# Altium schematic sheet Sheet1.SchDoc
size A4
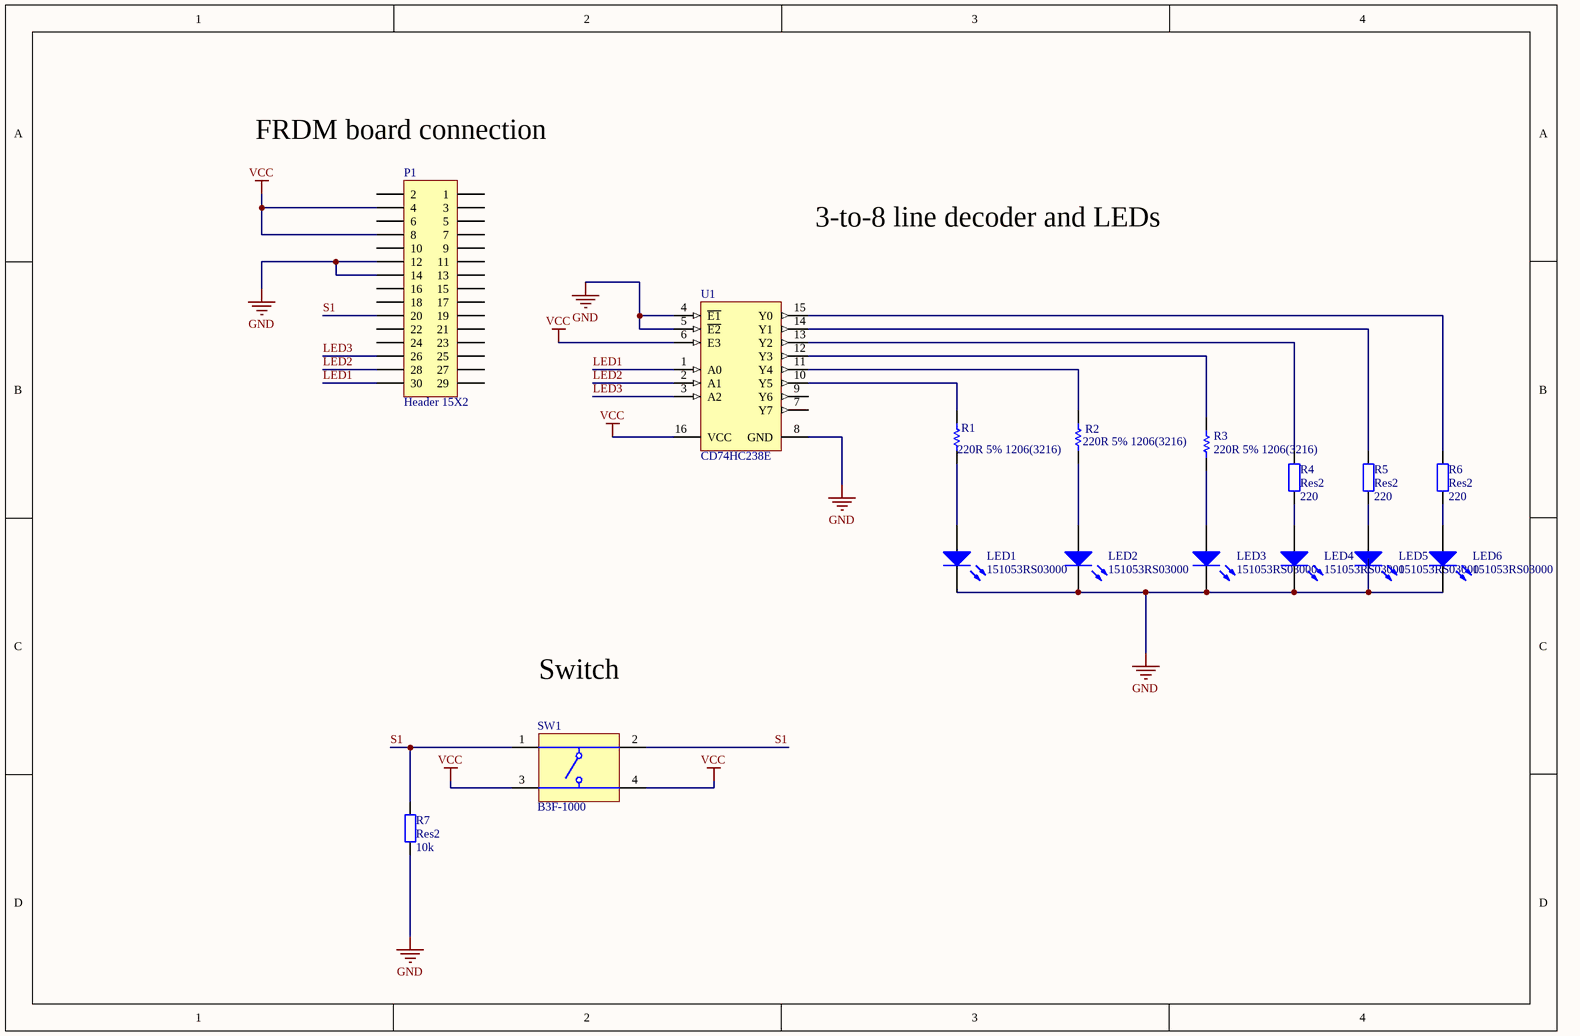
[diagram p0: Sheet1.SchDoc]

## Parts
LED1  151053RS03000  [Type 5mm]
LED2  151053RS03000  [Type 5mm]
LED3  151053RS03000  [Type 5mm]
LED4  151053RS03000  [Type 5mm]
LED5  151053RS03000  [Type 5mm]
LED6  151053RS03000  [Type 5mm]
P1  Header 15X2  [HDR2X15]
R1  220R 5% 1206(3216)  [RESC1206(3216)_M]
R2  220R 5% 1206(3216)  [RESC1206(3216)_M]
R3  220R 5% 1206(3216)  [RESC1206(3216)_M]
R4  Res2  value 220  [AXIAL-0.4]
R5  Res2  value 220  [AXIAL-0.4]
R6  Res2  value 220  [AXIAL-0.4]
R7  Res2  value 10k  [AXIAL-0.4]
SW1  B3F-1000  [OMRON-B3F-1000-4_V]
U1  CD74HC238E  [N0016A]

## Nets
GND: LED1.1(K) LED2.1(K) LED3.1(K) LED4.1(K) LED5.1(K) LED6.1(K) P1.12 P1.14 R7.1 U1.4(~{E1}) U1.5(~{E2}) U1.8(GND)
VCC: P1.4 P1.8 SW1.3 SW1.4 U1.6(E3) U1.16(VCC)
LED1: P1.30 U1.1(A0)
LED2: P1.28 U1.2(A1)
LED3: P1.26 U1.3(A2)
S1: P1.20 R7.2 SW1.1 SW1.2
NetLED1_2: LED1.2(A) R1.1
NetLED2_2: LED2.2(A) R2.1
NetLED3_2: LED3.2(A) R3.1
NetLED4_2: LED4.2(A) R4.1
NetLED5_2: LED5.2(A) R5.1
NetLED6_2: LED6.2(A) R6.1
NetR1_2: R1.2 U1.10(Y5)
NetR2_2: R2.2 U1.11(Y4)
NetR3_2: R3.2 U1.12(Y3)
NetR4_2: R4.2 U1.13(Y2)
NetR5_2: R5.2 U1.14(Y1)
NetR6_2: R6.2 U1.15(Y0)

Not connected (* = marked no-connect by the designer): P1 1 2 3 5 6 7 9 10 11 13 15 16 17 18 19 21 22 23 24 25 27 29; U1 7(Y7) 9(Y6)

## Notes on the sheet
- (near P1) FRDM board connection
- 3-to-8 line decoder and LEDs
- Switch

## Library data of the parts
LED1-LED6 = CMP-1489-00007-1: THT LED round mono-color waterclear,  WL-TMRW ,Red; Manufacturer: Wuerth Elektronik; PackageReference: Type 5mm; PartNumber: 151053RS03000; ComponentLink1URL: http://www.we-online.com; ComponentLink2Description: Datasheet; Emitting color: Red; ComponentLink2URL: http://katalog.we-online.de/pbs/datasheet/7448042001.pdfhttp://katalog.we-online.de/pbs/datasheet/7448042001.pdfhttp://katalog.we-online.de/pbs/datasheet/7448042001.pdfhttp://katalog.we-online.de/pbs/datasheet/151053RS03000.pdf; ComponentLink1Description: Manufacturer URL
P1 = Header 15X2: Header, 15-Pin, Dual row; LatestRevisionDate: 17-Jul-2002; LatestRevisionNote: Re-released for DXP Platform.; Publisher: Altium Limited
R1-R3 = CMP-1014-00058-1: 220R 0.25W 5% 1206 (3216 Metric)  SMD; Case-EIA: 1206; Case-Metric: 3216; Value: 220.00 Ohm; Power: 0.25 W; Technology: SMT; Tolerance: 5 %
R4-R7 = Res2: Resistor; Published: 8-Jun-2000; LatestRevisionDate: 17-Jul-2002; LatestRevisionNote: Re-released for DXP Platform.; PackageReference: AXIAL-0.4; Publisher: Altium Limited; PackageDescription: Axial Device, Thru-Hole; 2 Leads; 0.4 in Pin Spacing
SW1 = CMP-1677-00002-1: Tactile Switch, SPST-NO, 0.05 A, 5 to 24 V, -25 to 70 degC, 4-Pin THD, RoHS, Bulk; Shielding: Shielded; Gender: Female; Capacitance: -45 f; Voltage Rating: 150 V; Current Rating: 1.5 A; Radiation Hardening: No; Contact Plating: Gold; Height: 14.99 mm; Min Operating Temperature: -40 degC; Packaging: Tray; ComponentLink2Description: Datasheet; ComponentLink1URL: http://www.omron.com/; Lead Pitch: 1.27 mm; RoHSCompliant: true; Pins: 8; PackageReference: B3F-1000; Width: 25.4 mm; Contact Material: Brass; ComponentLink2URL: http://www.omron.com/ecb/products/pdf/en-b3f.pdf; PackageDescription: 4-Pin Through Hole Device, Body 6 x 6 mm; DatasheetVersion: Jan-15; ComponentLink1Description: Manufacturer URL; Package Quantity: 1080; Mount: Through Hole; Length: 18.34 mm; Max Operating Temperature: 70 degC
U1 = CMP-1633-00674-2: High Speed CMOS Logic 3-to-8 Line Decoder Demultiplexer Inverting and Non-Inverting, N0016A, TUBE; Manufacturer: Texas Instruments; ICC @ Nom Voltage(Max)(mA): 0.08; VCC(Max)(V): 6; Schmitt Trigger: No; Output Drive (IOL/IOH)(Max)(mA): 5.2/-5.2; Channels(#): 1; Function: Decoder/Demultiplexer; tpd @ Nom Voltage(Max)(ns): 30; VCC(Min)(V): 2; Voltage(Nom)(V): 3.3,5; Input Type: LVTTL/CMOS; Technology Family: HC; Bits(#): 8; Configuration: 3：8; Rating: Catalog; F @ Nom Voltage(Max)(Mhz): 28; Code_JEDEC: MS-001; DatasheetVersion: SCHS147I; Type: Standard; Operating Temperature Range(C): -55 to 125; Generic Part Number: CD74HC238; PackageReference: N0016A; Output Type: CMOS